# EAGLE design i-uC-IO-extention (EAGLE 5.07)
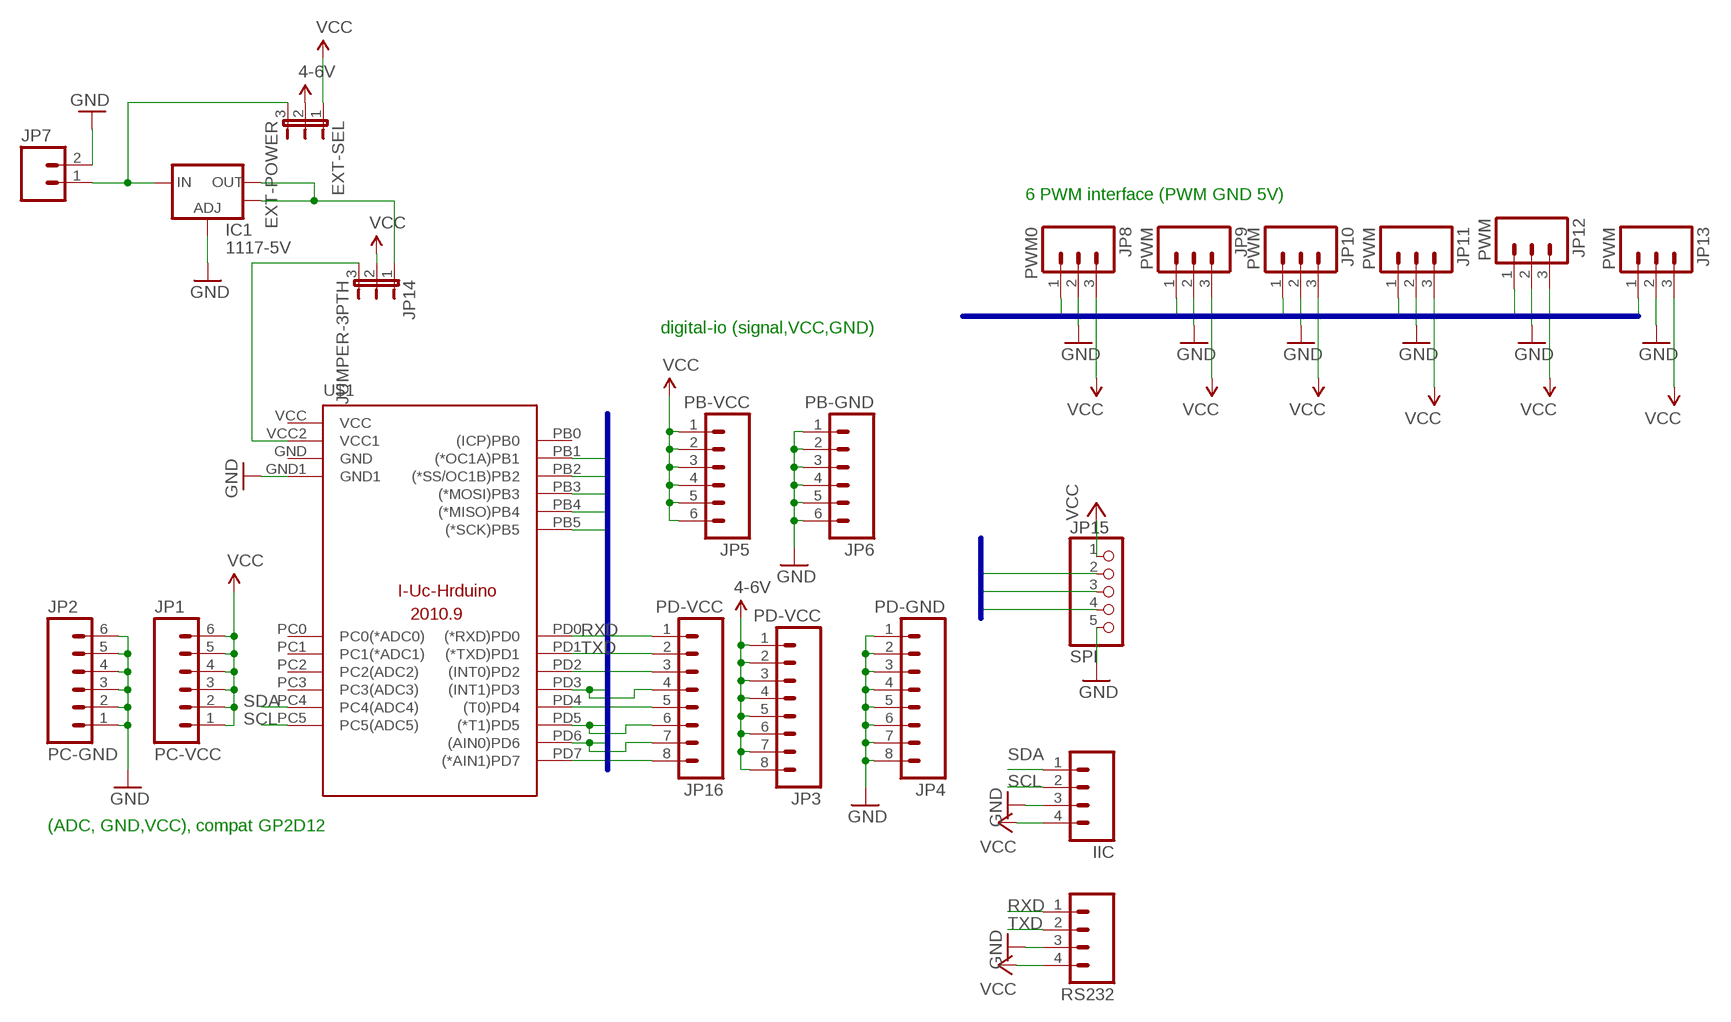
[diagram p0: schematic, sheet 1]

## Parts
EXT-SEL  EXT-POWER  JUMPER-3PTH  [1X03]
IC1  1117-5V  V_REG_LM1117SOT223  [SOT223]
IIC  M04LOCK  [1X04_LOCK]
JP1  PC-VCC  M06LOCK  [1X06_LOCK]
JP2  PC-GND  M06LOCK  [1X06_LOCK]
JP3  PD-VCC  M08  [1X08]
JP4  PD-GND  M08LOCK  [1X08_LOCK]
JP5  PB-VCC  M06LOCK  [1X06_LOCK]
JP6  PB-GND  M06LOCK  [1X06_LOCK]
JP7  M025MM  [SCREWTERMINAL-5MM-2]
JP8  PWM0  M03LOCK  [1X03_LOCK]
JP9  PWM  M03LOCK  [1X03_LOCK]
JP10  PWM  M03LOCK  [1X03_LOCK]
JP11  PWM  M03LOCK  [1X03_LOCK]
JP12  PWM  M03LOCK  [1X03_LOCK]
JP13  PWM  M03LOCK  [1X03_LOCK]
JP14  JUMPER-3PTH  [1X03]
JP15  SPI  PINHD-1X5  [1X05]
JP16  PD-VCC  M08  [1X08]
RS232  M04LOCK  [1X04_LOCK]
U$1  I-UC-V0/EXT-V0  [I-UC-V0-EXT-V0]

## Nets
4-6V: EXT-SEL.2 JP3.1 JP3.2 JP3.3 JP3.4 JP3.5 JP3.6 JP3.7 JP3.8
GND: IC1.1(ADJ) IIC.3 JP2.1 JP2.2 JP2.3 JP2.4 JP2.5 JP2.6 JP4.1 JP4.2 JP4.3 JP4.4 JP4.5 JP4.6 JP4.7 JP4.8 JP6.1 JP6.2 JP6.3 JP6.4 JP6.5 JP6.6 JP7.2 JP8.2 JP9.2 JP10.2 JP11.2 JP12.2 JP13.2 JP15.5 RS232.3 U$1.GND1
N$1: EXT-SEL.3 IC1.3(IN) JP7.1
N$2: IC1.2(OUT) IC1.4(OUT) JP14.1
N$5: JP14.3 U$1.VCC2(VCC1)
N$6: JP16.3 U$1.PD2((INT0)PD2)
N$8: JP16.5 U$1.PD4((T0)PD4)
N$11: JP16.8 U$1.PD7((*AIN1)PD7)
PB1: JP8.1 U$1.PB1((*OC1A)PB1)
PB2: JP9.1 U$1.PB2((*SS/OC1B)PB2)
PB3: JP10.1 JP15.2 U$1.PB3((*MOSI)PB3)
PB4: JP15.3 U$1.PB4((*MISO)PB4)
PB5: JP15.4 U$1.PB5((*SCK)PB5)
PD3: JP11.1 JP16.4 U$1.PD3((INT1)PD3)
PD5: JP12.1 JP16.6 U$1.PD5((*T1)PD5)
PD6: JP13.1 JP16.7 U$1.PD6((AIN0)PD6)
RXD: JP16.1 RS232.1 U$1.PD0((*RXD)PD0)
SCL: IIC.2 U$1.PC5(PC5(ADC5))
SDA: IIC.1 U$1.PC4(PC4(ADC4))
TXD: JP16.2 RS232.2 U$1.PD1((*TXD)PD1)
VCC: EXT-SEL.1 IIC.4 JP1.1 JP1.2 JP1.3 JP1.4 JP1.5 JP1.6 JP5.1 JP5.2 JP5.3 JP5.4 JP5.5 JP5.6 JP8.3 JP9.3 JP10.3 JP11.3 JP12.3 JP13.3 JP14.2 JP15.1 RS232.4
Unconnected: U$1.GND U$1.PB0((ICP)PB0) U$1.PC0(PC0(*ADC0)) U$1.PC1(PC1(*ADC1)) U$1.PC2(PC2(ADC2)) U$1.PC3(PC3(ADC3)) U$1.VCC

## Buses
B$1
B$2
B$3

## Notes on the sheet
- 6 PWM interface (PWM GND 5V)
- digital-io (signal,VCC,GND)
- (ADC, GND,VCC), compat GP2D12

## Library data of the parts
EXT-SEL JP14 = SparkFun:JUMPER-3
IC1 = SparkFun:V_REG_LM1117: Voltage Regulator LM1117 Standard adjustable voltage regulator but in SMD form. Spark Fun Electronics SKU : COM-00595
IIC RS232 = SparkFun:M04: Header 4 Standard 4-pin 0.1" header. Use with straight break away headers (SKU : PRT-00116), right angle break away headers (PRT-00553), swiss pins (PRT-00743), machine pins (PRT-00117), and female headers (PRT-00115). Molex polarized connector foot print use with SKU : PRT-08231 with associated crimp pins and housings.
JP1 JP2 JP5 JP6 = SparkFun:M06: Header 6 Standard 6-pin 0.1" header. Use with straight break away headers (SKU : PRT-00116), right angle break away headers (PRT-00553), swiss pins (PRT-00743), machine pins (PRT-00117), and female headers (PRT-00115). Molex polarized connector foot print use with SKU : PRT-08094 with associated crimp pins and housings. NOTES ON THE VARIANTS LOCK and LOCK_LONGPADS... This footprint was designed to help hold the alignment of a through-hole component (i.e. 6-pin header) while soldering it into place. You may notice that each hole has been shifted either up or down by 0.005 of an inch from it's more standard position (which is a perfectly straight line). This slight alteration caused the pins (the squares in the middle) to touch the edges of the holes. Because they are alternating, it causes a "brace" to hold the component in place. 0.005 has proven to be the perfect amount of "off-center" position when using our standard breakaway headers. Although looks a little odd when you look at the bare footprint, once you have a header in there, the alteration is very hard to notice. Also, if you push a header all the way into place, it is covered up entirely on the bottom side. This idea of altering the position of holes to aid alignment will be further integrated into the Sparkfun Library for other footprints. It can help hold any component with 3 or more connection pins.
JP3 JP4 JP16 = SparkFun:M08: Header 8 Standard 8-pin 0.1" header. Use with straight break away headers (SKU : PRT-00116), right angle break away headers (PRT-00553), swiss pins (PRT-00743), machine pins (PRT-00117), and female headers (PRT-00115).
JP7 = SparkFun:M02: Header 2 Standard 2-pin 0.1" header. Use with straight break away headers (SKU : PRT-00116), right angle break away headers (PRT-00553), swiss pins (PRT-00743), machine pins (PRT-00117), and female headers (PRT-00115). Molex polarized connector foot print use with SKU : PRT-08233 with associated crimp pins and housings.
JP8-JP13 = SparkFun:M03: Header 3 Standard 3-pin 0.1" header. Use with straight break away headers (SKU : PRT-00116), right angle break away headers (PRT-00553), swiss pins (PRT-00743), machine pins (PRT-00117), and female headers (PRT-00115). Molex polarized connector foot print use with SKU : PRT-08232 with associated crimp pins and housings.
JP15 = pinhead:PINHD-1X5: PIN HEADER
U$1 = digital-toy:I-UC-V0

## Board
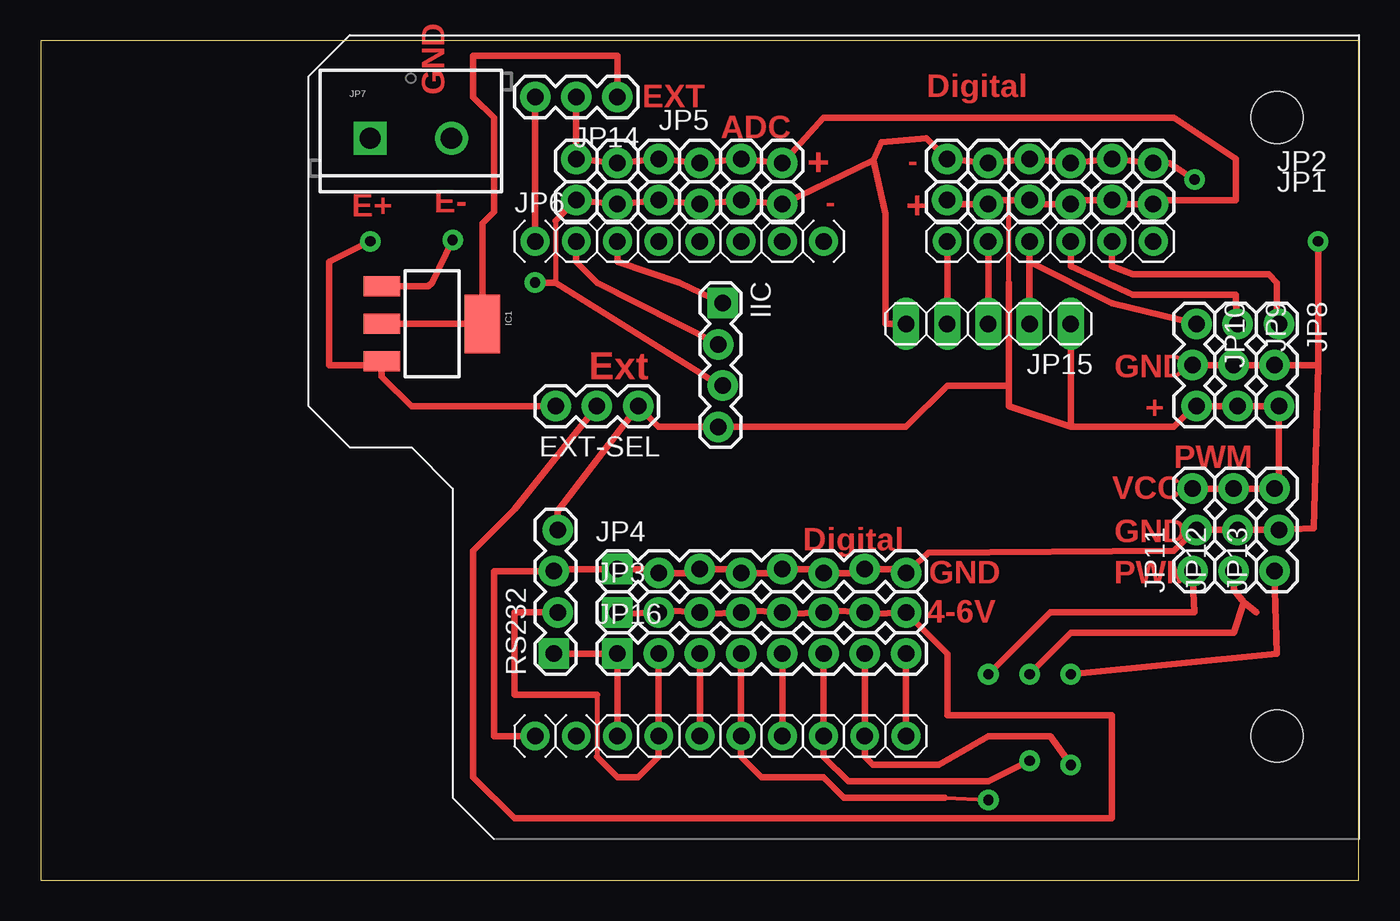
[diagram p1: board, top side]
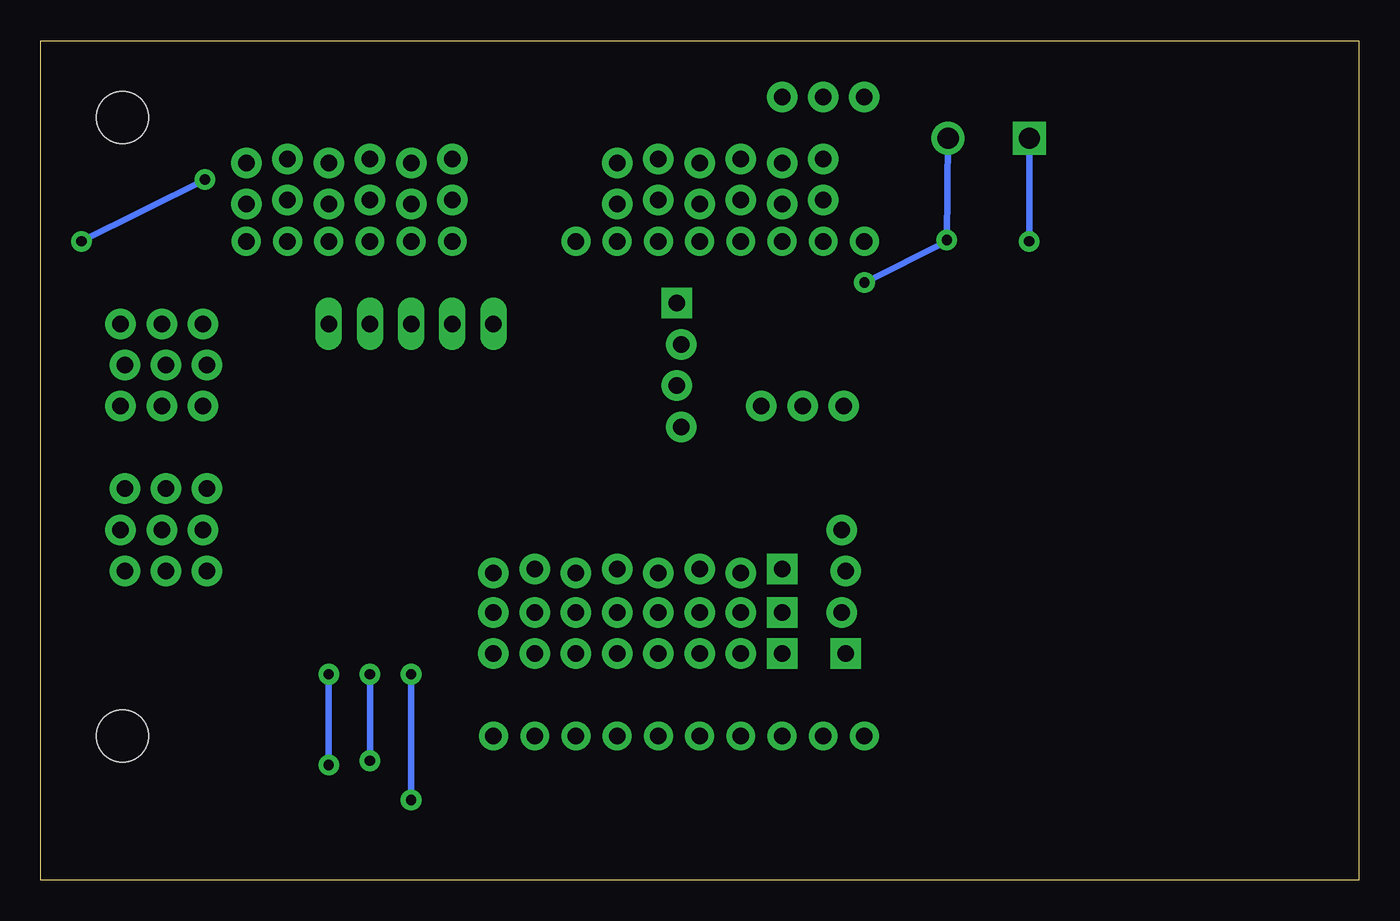
[diagram p2: board, bottom side, seen from below]

Size 81.26 x 51.74 mm. Coordinates in mm from the lower left corner, seen from the top.
Outline: 0,0 81.26,0 81.26,51.74 0,51.74 0,0
Copper layers (1*16): Top 0.035mm / dielectric 1.5mm / Bottom 0.035mm
Design rules "SparkFun": minimum track width 8mil, minimum drill 20mil, track to track 8mil, track to pad 8mil, pad to pad 8mil, via to via 8mil, smd to smd 8mil, copper to edge 10mil, drill to drill 8mil, minimum pad ring 12mil, minimum via ring 10mil, stop-mask expansion 4mil, vias tented up to drill 25mil, thermal gap 10mil

### Footprints (pad centres in the part's own frame; a part is rotated, then mirrored left to right if it is on the bottom)
1X03 = drill 1.016 pad 1.88 round: 1 0,0; 2 2.54,0; 3 5.08,0
SOT223 = smd 1.219 x 2.235: 1 -2.311,-3.099; 2 0,-3.099; 3 2.311,-3.099 | smd 3.6 x 2.2: 4 0,3.099
1X04_LOCK = drill 1.016 pad 1.88 square: 1 0,0.127 | drill 1.016 pad 1.88 round: 2 2.54,-0.127; 3 5.08,0.127; 4 7.62,-0.127
1X06_LOCK = drill 1.016 pad 1.88 round: 1 0,0; 2 2.54,-0.254; 3 5.08,0; 4 7.62,-0.254; 5 10.16,0; 6 12.7,-0.254
1X08 = drill 1.016 pad 1.88 square: 1 0,0 | drill 1.016 pad 1.88 round: 2 2.54,0; 3 5.08,0; 4 7.62,0; 5 10.16,0; 6 12.7,0; 7 15.24,0; 8 17.78,0
1X08_LOCK = drill 1.016 pad 1.88 square: 1 0,0.127 | drill 1.016 pad 1.88 round: 2 2.54,-0.127; 3 5.08,0.127; 4 7.62,-0.127; 5 10.16,0.127; 6 12.7,-0.127; 7 15.24,0.127; 8 17.78,-0.127
SCREWTERMINAL-5MM-2 = drill 1.3 pad 2.032 square: 1 0,0 | drill 1.3 pad 2.032 round: 2 5,0
1X03_LOCK = drill 1.016 pad 1.88 round: 1 0,0.127; 2 2.54,-0.127; 3 5.08,0.127
1X05 = drill 1.016 long: 1 -5.08,0; 2 -2.54,0; 3 0,0; 4 2.54,0; 5 5.08,0
I-UC-V0-EXT-V0 = drill 1.016 pad 1.778 round: GND 48.26,36.83; GND1 30.48,6.35; PB0 68.58,36.83; PB1 66.04,36.83; PB2 63.5,36.83; PB3 60.96,36.83; PB4 58.42,36.83; PB5 55.88,36.83; PC0 45.72,36.83; PC1 43.18,36.83; PC2 40.64,36.83; PC3 38.1,36.83; PC4 35.56,36.83; PC5 33.02,36.83; PD0 35.56,6.35; PD1 38.1,6.35; PD2 40.64,6.35; PD3 43.18,6.35; PD4 45.72,6.35; PD5 48.26,6.35; PD6 50.8,6.35; PD7 53.34,6.35; VCC 33.02,6.35; VCC2 30.48,36.83 | hole 3.2: 76.2,44.45; 76.2,6.35

### Placement (x,y rotation side)
EXT-SEL  36.83,29.21 180 top
IC1  24.13,34.29 270 top
IIC  41.91,35.56 270 top
JP1  55.88,41.91 0 top
JP2  55.88,44.45 0 top
JP3  35.56,16.51 0 top
JP4  35.56,19.05 0 top
JP5  33.02,44.45 0 top
JP6  33.02,41.91 0 top
JP7  20.32,45.72 0 top
JP8  76.2,34.29 270 top
JP9  73.66,34.29 270 top
JP10  71.12,34.29 270 top
JP11  71.12,19.05 90 top
JP12  73.66,19.05 90 top
JP13  76.2,19.05 90 top
JP14  35.56,48.26 180 top
JP15  58.42,34.29 180 top
JP16  35.56,13.97 0 top
RS232  31.75,13.97 90 top
U$1  0,2.54 0 top

### Tracks (layer width: path | path; a pad name or v marks a point on that pad's centre or on a via)
4-6V
  Top 0.406: JP3.1 35.81,16.38 JP3.2 38.35,16.64 JP3.3 40.89,16.38 JP3.4 43.43,16.64 JP3.5 45.97,16.38 JP3.6 48.51,16.64 JP3.7 51.05,16.38 JP3.8 55.88,13.97 55.88,10.16 66.04,10.16 66.04,3.81 29.21,3.81 26.67,6.35 26.67,20.32 29.21,22.86 EXT-SEL.2
GND  (via drill 0.64 pad 1.27)
  Top 0.305: 31.75,40.64 31.75,36.83
  Top 0.406: 78.74,31.75 78.48,21.69 JP13.2 JP12.2 JP11.2 69.85,20.32 54.74,20.19 JP4.8 53.09,19.18 JP4.7 50.55,18.92 JP4.6 48.01,19.18 JP4.5 45.47,18.92 JP4.4 42.93,19.18 JP4.3 40.39,18.92 JP4.2 37.85,19.18 JP4.1 31.88,19.18 31.75,19.05 RS232.3 27.94,19.05 27.94,8.89 U$1.GND1 | 78.74,31.75 JP8.2 JP9.2 JP10.2 | 51.33,44.37 51.82,45.47 54.61,45.72 JP2.1 JP2.2 JP2.3 JP2.4 JP2.5 JP2.6 69.6,44.2 v71.12,43.18 | 51.33,44.37 JP6.6 JP6.5 JP6.4 JP6.3 JP6.2 JP6.1 31.75,40.64 | 78.74,31.75 v78.74,39.37 | IIC.3 41.91,30.48 31.75,36.83 v30.48,36.83 | IC1.1 23.9,36.6 24.13,36.83 v25.4,39.45 | JP15.5 52.07,34.29 52.07,41.09 51.33,44.37
  Bottom 0.406: v78.74,39.37 v71.12,43.18 | JP7.2 v25.4,39.45 25.4,39.37 v30.48,36.83
N$1  (via drill 0.64 pad 1.27)
  Top 0.406: v20.32,39.37 17.78,38.1 17.78,31.75 20.8,31.75 IC1.3 21.03,31.04 22.86,29.21 EXT-SEL.3
  Bottom 0.406: v20.32,39.37 JP7.1
N$2
  Top 0.406: JP14.1 35.56,50.8 26.67,50.8 26.67,48.26 27.94,46.99 27.94,41.2 27.23,40.49 IC1.4 IC1.2
N$5
  Top 0.406: U$1.VCC2 JP14.3
N$6
  Top 0.406: U$1.PD2 JP16.3
N$8
  Top 0.406: U$1.PD4 JP16.5
N$11
  Top 0.406: U$1.PD7 JP16.8
PB1
  Top 0.406: U$1.PB1 66.04,37.85 67.31,37.34 75.69,37.34 76.2,36.83 76.2,34.42 JP8.1
PB2
  Top 0.406: U$1.PB2 63.5,37.85 67.31,36.07 73.66,36.07 73.66,35.56 JP9.1
PB3
  Top 0.406: 60.96,38.1 U$1.PB3 | 60.96,38.1 66.04,35.56 JP10.1 | JP15.2 60.96,38.1
PB4
  Top 0.406: JP15.3 U$1.PB4
PB5
  Top 0.406: JP15.4 U$1.PB5
PD3  (via drill 0.64 pad 1.27)
  Top 0.254: 55.75,5.08 v58.42,4.95
  Top 0.406: 55.75,5.08 49.53,5.08 48.26,6.35 44.45,6.35 43.18,7.62 U$1.PD3 JP16.4 | JP11.1 71.12,16.51 62.23,16.51 v58.42,12.7
  Bottom 0.406: v58.42,4.95 v58.42,12.7
PD5  (via drill 0.64 pad 1.27)
  Top 0.406: 74.17,17.13 74.93,16.51 | 74.17,17.13 73.53,17.91 JP12.1 | v60.96,12.7 63.5,15.24 73.55,15.24 74.17,17.13 | v60.96,7.37 58.42,6.1 49.78,6.1 48.26,7.62 U$1.PD5 JP16.6
  Bottom 0.406: v60.96,7.37 v60.96,12.7
PD6  (via drill 0.64 pad 1.27)
  Top 0.406: v63.5,12.7 76.2,13.97 76.07,17.91 JP13.1 | v63.5,7.11 62.23,8.89 58.42,8.89 55.37,7.11 51.31,7.11 50.8,7.62 U$1.PD6 JP16.7
  Bottom 0.406: v63.5,7.11 v63.5,12.7
RXD
  Top 0.406: U$1.PD0 JP16.1 RS232.1
SCL
  Top 0.406: U$1.PC5 33.02,38.1 34.29,36.83 IIC.2
SDA
  Top 0.406: U$1.PC4 35.56,38.1 39.37,36.83 IIC.1
TXD
  Top 0.305: 34.29,11.43 34.29,7.62
  Top 0.406: JP16.2 U$1.PD1 38.1,7.62 36.83,6.35 35.56,6.35 34.29,7.62 | RS232.2 29.21,16.51 29.21,11.43 34.29,11.43
VCC
  Top 0.254: JP1.6 68.83,41.91 | 76.33,24.38 JP13.3
  Top 0.305: 59.69,36.83 59.69,41.91
  Top 0.406: 68.83,41.91 73.66,41.91 73.66,44.45 69.85,46.99 48.26,46.99 JP5.6 JP5.5 JP5.4 JP5.3 JP5.2 JP5.1 JP14.2 | JP1.6 66.29,41.66 JP1.5 63.75,41.91 JP1.4 61.21,41.66 JP1.3 59.69,41.91 58.67,41.91 JP1.2 56.13,41.66 JP1.1 | 76.33,24.38 JP8.3 JP9.3 JP10.3 71.12,29.21 69.85,27.94 63.5,27.94 | JP13.3 JP12.3 JP11.3 | 59.69,30.48 59.69,36.83 | 59.69,30.48 59.69,29.21 63.5,27.94 | 63.5,27.94 JP15.1 | RS232.4 31.88,22.73 EXT-SEL.1 38.1,27.94 IIC.4 53.34,27.94 55.88,30.48 59.69,30.48

### Text on the board
Top: GND | Digital | EXT | ADC | + | - | E- | - | E+ | + | Ext | GND | + | PWM | VCC | Digital | GND | GND | PWM | 4-6V